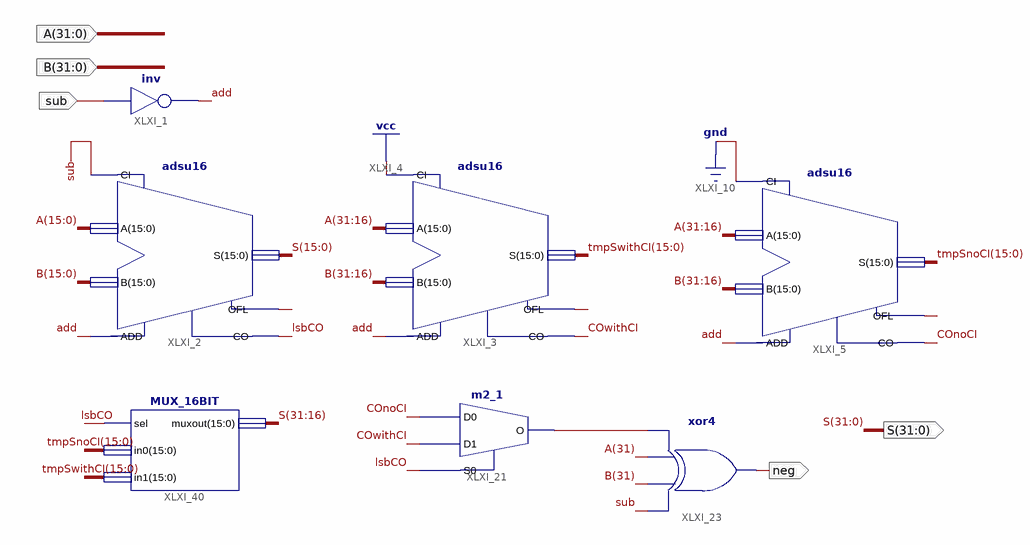
[diagram p0: schematic sheet 1]
// Xilinx ISE schematic ADDSUB32.sch (spartan6) as structural Verilog: 7 symbols, 5 ports
module ADDSUB32 (
  input  sub,
  input  [31:0] B,
  input  [31:0] A,
  output [31:0] S,
  output neg
);

  wire add, COnoCI, COwithCI, lsbCO, XLXN_7, XLXN_23, XLXN_26, XLXN_92;
  wire [15:0] tmpSnoCI, tmpSwithCI;

  xor XLXI_23 (neg, sub, B[31], A[31], XLXN_92);
  m2_1 XLXI_21 (.D0(COnoCI), .D1(COwithCI), .S0(lsbCO), .O(XLXN_92));
  adsu16 XLXI_5 (.A(A[31:16]), .ADD(add), .B(B[31:16]), .CI(1'b0), .CO(COnoCI), .OFL(XLXN_26), .S(tmpSnoCI));
  adsu16 XLXI_3 (.A(A[31:16]), .ADD(add), .B(B[31:16]), .CI(1'b1), .CO(COwithCI), .OFL(XLXN_23), .S(tmpSwithCI));
  adsu16 XLXI_2 (.A(A[15:0]), .ADD(add), .B(B[15:0]), .CI(sub), .CO(lsbCO), .OFL(XLXN_7), .S(S[15:0]));
  not XLXI_1 (add, sub);
  MUX_16BIT XLXI_40 (.sel(lsbCO), .in0(tmpSnoCI), .in1(tmpSwithCI), .muxout(S[31:16]));
endmodule
